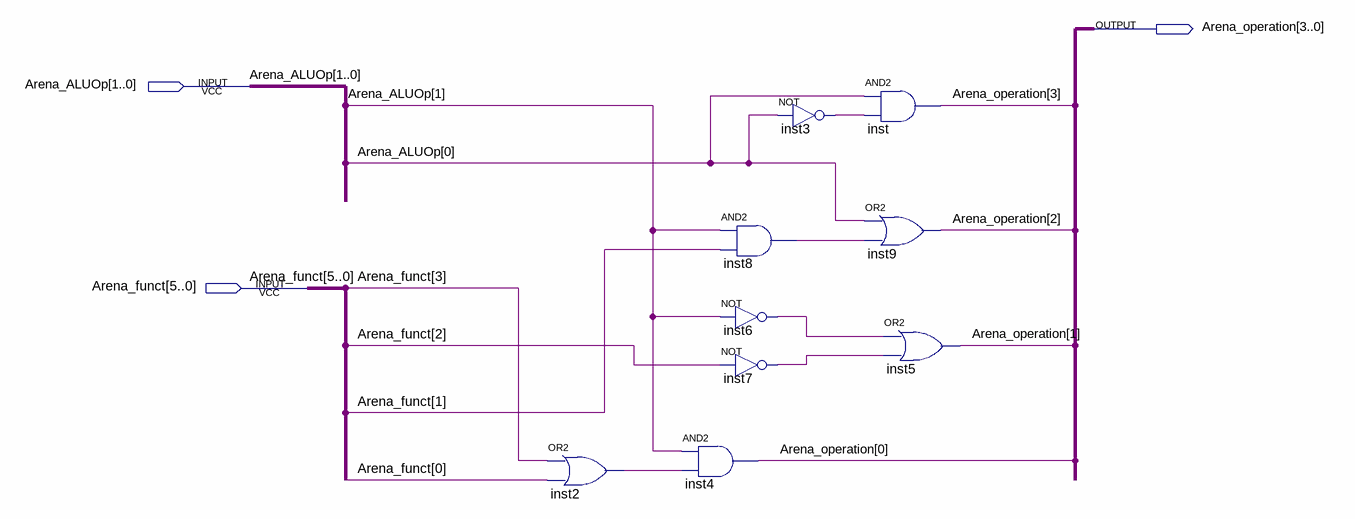
[diagram p0: schematic sheet]
// Quartus schematic Arena_ALU_Control.bdf as structural Verilog: 9 symbols, 3 pins
module Arena_ALU_Control (
  input  [1:0] Arena_ALUOp,
  input  [5:0] Arena_funct,
  output [3:0] Arena_operation
);

  wire inst2_out, inst3_out, inst6_out, inst7_out, inst8_out;

  or inst2 (inst2_out, Arena_funct[3], Arena_funct[0]);
  and inst8 (inst8_out, Arena_ALUOp[1], Arena_funct[1]);
  not inst6 (inst6_out, Arena_ALUOp[1]);
  not inst7 (inst7_out, Arena_funct[2]);
  and inst4 (Arena_operation[0], Arena_ALUOp[1], inst2_out);
  not inst3 (inst3_out, Arena_ALUOp[0]);
  and inst (Arena_operation[3], Arena_ALUOp[0], inst3_out);
  or inst9 (Arena_operation[2], Arena_ALUOp[0], inst8_out);
  or inst5 (Arena_operation[1], inst6_out, inst7_out);
endmodule
